# Altium schematic sheet Engine Bay and Rear Tube.SchDoc: =DocumentName
size 420 x 297 mm; Organization: Queen's Formula SAE; Address1: 130 Stuart St, Kingston; Address2: Ontario; Address3: Canada; Address4: K7L 2V9; DocumentNumber: 1; Revision: 0; SheetNumber: 1; SheetTotal: 1
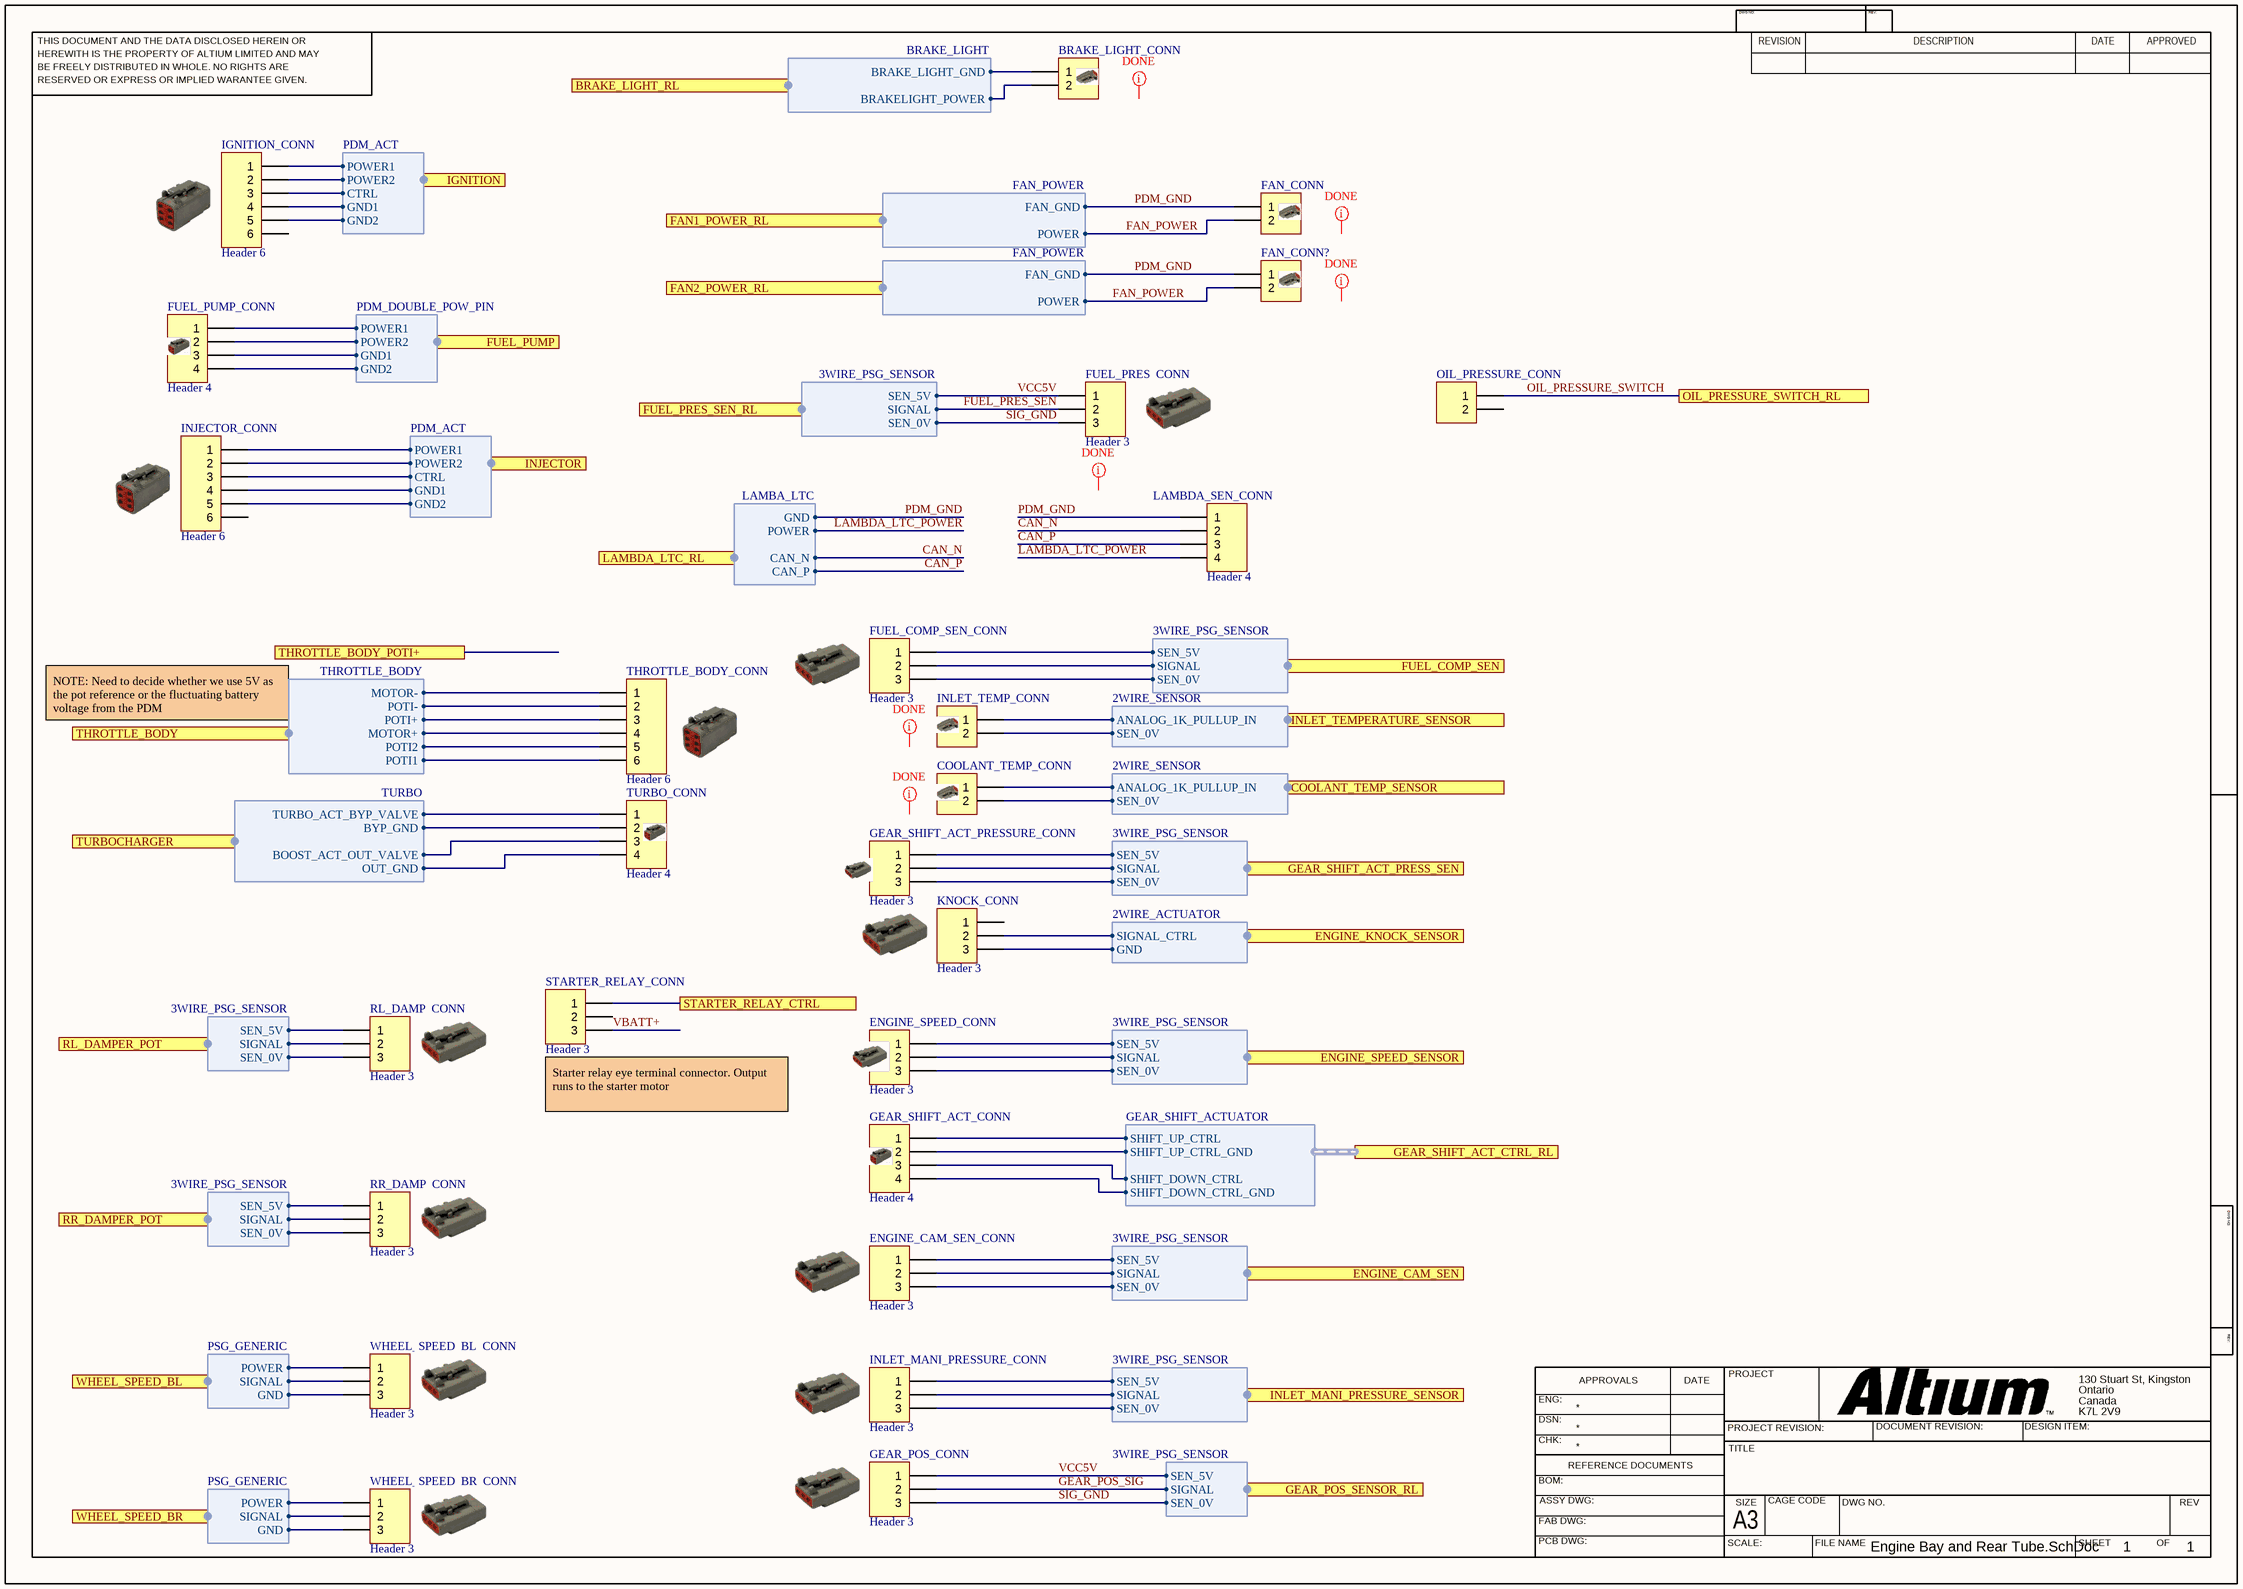
[diagram p0: Engine Bay and Rear Tube.SchDoc]

## Parts
BRAKE_LIGHT_CONN  Header 2  [HDR1X2]  (value not drawn)
COOLANT_TEMP_CONN  Header 2  [HDR1X2]  (value not drawn)
ENGINE_CAM_SEN_CONN  Header 3  [HDR1X3]
ENGINE_SPEED_CONN  Header 3  [HDR1X3]
FAN_CONN  Header 2  [HDR1X2]  (value not drawn)
FAN_CONN?  Header 2  [HDR1X2]  (value not drawn)
FUEL_COMP_SEN_CONN  Header 3  [HDR1X3]
FUEL_PRES_CONN  Header 3  [HDR1X3]
FUEL_PUMP_CONN  Header 4  [HDR1X4]
GEAR_POS_CONN  Header 3  [HDR1X3]
GEAR_SHIFT_ACT_CONN  Header 4  [HDR1X4]
GEAR_SHIFT_ACT_PRESSURE_CONN  Header 3  [HDR1X3]
IGNITION_CONN  Header 6  [HDR1X6]
INJECTOR_CONN  Header 6  [HDR1X6]
INLET_MANI_PRESSURE_CONN  Header 3  [HDR1X3]
INLET_TEMP_CONN  Header 2  [HDR1X2]  (value not drawn)
KNOCK_CONN  Header 3  [HDR1X3]
LAMBDA_SEN_CONN  Header 4  [HDR1X4]
OIL_PRESSURE_CONN  Header 2  [HDR1X2]  (value not drawn)
RL_DAMP_CONN  Header 3  [HDR1X3]
RR_DAMP_CONN  Header 3  [HDR1X3]
STARTER_RELAY_CONN  Header 3  [HDR1X3]
THROTTLE_BODY_CONN  Header 6  [HDR1X6]
TURBO_CONN  Header 4  [HDR1X4]
WHEEL_SPEED_BL_CONN  Header 3  [HDR1X3]
WHEEL_SPEED_BR_CONN  Header 3  [HDR1X3]

## Ports
BRAKE_LIGHT_RL (harness BRAKE_LIGHT), COOLANT_TEMP_SENSOR (harness 2WIRE_SENSOR), ENGINE_CAM_SEN (harness 3WIRE_PSG_SENSOR), ENGINE_KNOCK_SENSOR (harness 2WIRE_ACTUATOR), ENGINE_SPEED_SENSOR (harness 3WIRE_PSG_SENSOR), FAN1_POWER_RL (harness FAN_POWER), FAN2_POWER_RL (harness FAN_POWER), FUEL_COMP_SEN (harness 3WIRE_PSG_SENSOR), FUEL_PRES_SEN_RL (harness 3WIRE_PSG_SENSOR), FUEL_PUMP (harness PDM_DOUBLE_POW_PIN), GEAR_POS_SENSOR_RL (harness 3WIRE_PSG_SENSOR), GEAR_SHIFT_ACT_CTRL_RL (harness GEAR_SHIFT_ACTUATOR), GEAR_SHIFT_ACT_PRESS_SEN (harness 3WIRE_PSG_SENSOR), IGNITION (harness PDM_ACT), INJECTOR (harness PDM_ACT), INLET_MANI_PRESSURE_SENSOR (harness 3WIRE_PSG_SENSOR), INLET_TEMPERATURE_SENSOR (harness 2WIRE_SENSOR), LAMBDA_LTC_RL (harness LAMBA_LTC), OIL_PRESSURE_SWITCH_RL, RL_DAMPER_POT (harness 3WIRE_PSG_SENSOR), RR_DAMPER_POT (harness 3WIRE_PSG_SENSOR), STARTER_RELAY_CTRL, THROTTLE_BODY (harness THROTTLE_BODY), THROTTLE_BODY_POTI+, TURBOCHARGER (harness TURBO), WHEEL_SPEED_BL (harness PSG_GENERIC), WHEEL_SPEED_BR (harness PSG_GENERIC)

## Harnesses
2WIRE_SENSOR: ANALOG_1K_PULLUP_IN, SEN_0V
3WIRE_PSG_SENSOR: SEN_5V, SEN_0V, SIGNAL
2WIRE_ACTUATOR: SIGNAL_CTRL, GND
THROTTLE_BODY: MOTOR+, MOTOR-, POTI1, POTI2, POTI-, POTI+
GEAR_SHIFT_ACTUATOR: SHIFT_UP_CTRL, SHIFT_DOWN_CTRL, SHIFT_UP_CTRL_GND, SHIFT_DOWN_CTRL_GND
PDM_ACT: POWER1, CTRL, GND1, GND2, POWER2
TURBO: TURBO_ACT_BYP_VALVE, BOOST_ACT_OUT_VALVE, BYP_GND, OUT_GND
PDM_DOUBLE_POW_PIN: POWER1, GND1, GND2, POWER2
BRAKE_LIGHT: BRAKELIGHT_POWER, BRAKE_LIGHT_GND
PSG_GENERIC: POWER, GND, SIGNAL
FAN_POWER: POWER, FAN_GND
LAMBA_LTC: CAN_P, CAN_N, POWER, GND

## Nets
CAN_N: LAMBDA_SEN_CONN.2 ; port LAMBDA_LTC_RL.CAN_N
CAN_P: LAMBDA_SEN_CONN.3 ; port LAMBDA_LTC_RL.CAN_P
FAN_POWER: FAN_CONN.2 FAN_CONN?.2 ; port FAN1_POWER_RL.POWER, port FAN2_POWER_RL.POWER
FUEL_PRES_SEN: FUEL_PRES_CONN.2 ; port FUEL_PRES_SEN_RL.SIGNAL
GEAR_POS_SIG: GEAR_POS_CONN.2 ; port GEAR_POS_SENSOR_RL.SIGNAL
LAMBDA_LTC_POWER: LAMBDA_SEN_CONN.4 ; port LAMBDA_LTC_RL.POWER
OIL_PRESSURE_SWITCH: OIL_PRESSURE_CONN.1 ; port OIL_PRESSURE_SWITCH_RL
PDM_GND: FAN_CONN.1 FAN_CONN?.1 LAMBDA_SEN_CONN.1 ; port FAN1_POWER_RL.FAN_GND, port FAN2_POWER_RL.FAN_GND, port LAMBDA_LTC_RL.GND
SIG_GND: FUEL_PRES_CONN.3 GEAR_POS_CONN.3 ; port GEAR_POS_SENSOR_RL.SEN_0V, port FUEL_PRES_SEN_RL.SEN_0V
STARTER_RELAY_CTRL: STARTER_RELAY_CONN.1 ; port STARTER_RELAY_CTRL
VBATT+: STARTER_RELAY_CONN.3
VCC5V: FUEL_PRES_CONN.1 GEAR_POS_CONN.1 ; port GEAR_POS_SENSOR_RL.SEN_5V, port FUEL_PRES_SEN_RL.SEN_5V
NetBRAKE_LIGHT_CONN_1: BRAKE_LIGHT_CONN.1 ; port BRAKE_LIGHT_RL.BRAKE_LIGHT_GND
NetBRAKE_LIGHT_CONN_2: BRAKE_LIGHT_CONN.2 ; port BRAKE_LIGHT_RL.BRAKELIGHT_POWER
NetCOOLANT_TEMP_CONN_1: COOLANT_TEMP_CONN.1 ; port COOLANT_TEMP_SENSOR.ANALOG_1K_PULLUP_IN
NetCOOLANT_TEMP_CONN_2: COOLANT_TEMP_CONN.2 ; port COOLANT_TEMP_SENSOR.SEN_0V
NetENGINE_CAM_SEN_CONN_1: ENGINE_CAM_SEN_CONN.1 ; port ENGINE_CAM_SEN.SEN_5V
NetENGINE_CAM_SEN_CONN_2: ENGINE_CAM_SEN_CONN.2 ; port ENGINE_CAM_SEN.SIGNAL
NetENGINE_CAM_SEN_CONN_3: ENGINE_CAM_SEN_CONN.3 ; port ENGINE_CAM_SEN.SEN_0V
NetENGINE_SPEED_CONN_1: ENGINE_SPEED_CONN.1 ; port ENGINE_SPEED_SENSOR.SEN_5V
NetENGINE_SPEED_CONN_2: ENGINE_SPEED_CONN.2 ; port ENGINE_SPEED_SENSOR.SIGNAL
NetENGINE_SPEED_CONN_3: ENGINE_SPEED_CONN.3 ; port ENGINE_SPEED_SENSOR.SEN_0V
NetFUEL_COMP_SEN_CONN_1: FUEL_COMP_SEN_CONN.1 ; port FUEL_COMP_SEN.SEN_5V
NetFUEL_COMP_SEN_CONN_2: FUEL_COMP_SEN_CONN.2 ; port FUEL_COMP_SEN.SIGNAL
NetFUEL_COMP_SEN_CONN_3: FUEL_COMP_SEN_CONN.3 ; port FUEL_COMP_SEN.SEN_0V
NetFUEL_PUMP_CONN_1: FUEL_PUMP_CONN.1 ; port FUEL_PUMP.POWER1
NetFUEL_PUMP_CONN_2: FUEL_PUMP_CONN.2 ; port FUEL_PUMP.POWER2
NetFUEL_PUMP_CONN_3: FUEL_PUMP_CONN.3 ; port FUEL_PUMP.GND1
NetFUEL_PUMP_CONN_4: FUEL_PUMP_CONN.4 ; port FUEL_PUMP.GND2
NetGEAR_SHIFT_ACT_CONN_1: GEAR_SHIFT_ACT_CONN.1 ; port GEAR_SHIFT_ACT_CTRL_RL.SHIFT_UP_CTRL
NetGEAR_SHIFT_ACT_CONN_2: GEAR_SHIFT_ACT_CONN.2 ; port GEAR_SHIFT_ACT_CTRL_RL.SHIFT_UP_CTRL_GND
NetGEAR_SHIFT_ACT_CONN_3: GEAR_SHIFT_ACT_CONN.3 ; port GEAR_SHIFT_ACT_CTRL_RL.SHIFT_DOWN_CTRL
NetGEAR_SHIFT_ACT_CONN_4: GEAR_SHIFT_ACT_CONN.4 ; port GEAR_SHIFT_ACT_CTRL_RL.SHIFT_DOWN_CTRL_GND
NetGEAR_SHIFT_ACT_PRESSURE_CONN_1: GEAR_SHIFT_ACT_PRESSURE_CONN.1 ; port GEAR_SHIFT_ACT_PRESS_SEN.SEN_5V
NetGEAR_SHIFT_ACT_PRESSURE_CONN_2: GEAR_SHIFT_ACT_PRESSURE_CONN.2 ; port GEAR_SHIFT_ACT_PRESS_SEN.SIGNAL
NetGEAR_SHIFT_ACT_PRESSURE_CONN_3: GEAR_SHIFT_ACT_PRESSURE_CONN.3 ; port GEAR_SHIFT_ACT_PRESS_SEN.SEN_0V
NetIGNITION_CONN_1: IGNITION_CONN.1 ; port IGNITION.POWER1
NetIGNITION_CONN_2: IGNITION_CONN.2 ; port IGNITION.POWER2
NetIGNITION_CONN_3: IGNITION_CONN.3 ; port IGNITION.CTRL
NetIGNITION_CONN_4: IGNITION_CONN.4 ; port IGNITION.GND1
NetIGNITION_CONN_5: IGNITION_CONN.5 ; port IGNITION.GND2
NetINJECTOR_CONN_1: INJECTOR_CONN.1 ; port INJECTOR.POWER1
NetINJECTOR_CONN_2: INJECTOR_CONN.2 ; port INJECTOR.POWER2
NetINJECTOR_CONN_3: INJECTOR_CONN.3 ; port INJECTOR.CTRL
NetINJECTOR_CONN_4: INJECTOR_CONN.4 ; port INJECTOR.GND1
NetINJECTOR_CONN_5: INJECTOR_CONN.5 ; port INJECTOR.GND2
NetINLET_MANI_PRESSURE_CONN_1: INLET_MANI_PRESSURE_CONN.1 ; port INLET_MANI_PRESSURE_SENSOR.SEN_5V
NetINLET_MANI_PRESSURE_CONN_2: INLET_MANI_PRESSURE_CONN.2 ; port INLET_MANI_PRESSURE_SENSOR.SIGNAL
NetINLET_MANI_PRESSURE_CONN_3: INLET_MANI_PRESSURE_CONN.3 ; port INLET_MANI_PRESSURE_SENSOR.SEN_0V
NetINLET_TEMP_CONN_1: INLET_TEMP_CONN.1 ; port INLET_TEMPERATURE_SENSOR.ANALOG_1K_PULLUP_IN
NetINLET_TEMP_CONN_2: INLET_TEMP_CONN.2 ; port INLET_TEMPERATURE_SENSOR.SEN_0V
NetKNOCK_CONN_2: KNOCK_CONN.2 ; port ENGINE_KNOCK_SENSOR.SIGNAL_CTRL
NetKNOCK_CONN_3: KNOCK_CONN.3 ; port ENGINE_KNOCK_SENSOR.GND
NetRL_DAMP_CONN_1: RL_DAMP_CONN.1 ; port RL_DAMPER_POT.SEN_5V
NetRL_DAMP_CONN_2: RL_DAMP_CONN.2 ; port RL_DAMPER_POT.SIGNAL
NetRL_DAMP_CONN_3: RL_DAMP_CONN.3 ; port RL_DAMPER_POT.SEN_0V
NetRR_DAMP_CONN_1: RR_DAMP_CONN.1 ; port RR_DAMPER_POT.SEN_5V
NetRR_DAMP_CONN_2: RR_DAMP_CONN.2 ; port RR_DAMPER_POT.SIGNAL
NetRR_DAMP_CONN_3: RR_DAMP_CONN.3 ; port RR_DAMPER_POT.SEN_0V
NetTHROTTLE_BODY_CONN_1: THROTTLE_BODY_CONN.1 ; port THROTTLE_BODY.MOTOR-
NetTHROTTLE_BODY_CONN_2: THROTTLE_BODY_CONN.2 ; port THROTTLE_BODY.POTI-
NetTHROTTLE_BODY_CONN_3: THROTTLE_BODY_CONN.3 ; port THROTTLE_BODY.POTI+
NetTHROTTLE_BODY_CONN_4: THROTTLE_BODY_CONN.4 ; port THROTTLE_BODY.MOTOR+
NetTHROTTLE_BODY_CONN_5: THROTTLE_BODY_CONN.5 ; port THROTTLE_BODY.POTI2
NetTHROTTLE_BODY_CONN_6: THROTTLE_BODY_CONN.6 ; port THROTTLE_BODY.POTI1
NetTURBO_CONN_1: TURBO_CONN.1 ; port TURBOCHARGER.TURBO_ACT_BYP_VALVE
NetTURBO_CONN_2: TURBO_CONN.2 ; port TURBOCHARGER.BYP_GND
NetTURBO_CONN_3: TURBO_CONN.3 ; port TURBOCHARGER.BOOST_ACT_OUT_VALVE
NetTURBO_CONN_4: TURBO_CONN.4 ; port TURBOCHARGER.OUT_GND
NetWHEEL_SPEED_BL_CONN_1: WHEEL_SPEED_BL_CONN.1 ; port WHEEL_SPEED_BL.POWER
NetWHEEL_SPEED_BL_CONN_2: WHEEL_SPEED_BL_CONN.2 ; port WHEEL_SPEED_BL.SIGNAL
NetWHEEL_SPEED_BL_CONN_3: WHEEL_SPEED_BL_CONN.3 ; port WHEEL_SPEED_BL.GND
NetWHEEL_SPEED_BR_CONN_1: WHEEL_SPEED_BR_CONN.1 ; port WHEEL_SPEED_BR.POWER
NetWHEEL_SPEED_BR_CONN_2: WHEEL_SPEED_BR_CONN.2 ; port WHEEL_SPEED_BR.SIGNAL
NetWHEEL_SPEED_BR_CONN_3: WHEEL_SPEED_BR_CONN.3 ; port WHEEL_SPEED_BR.GND

Not connected (* = marked no-connect by the designer): IGNITION_CONN 6; INJECTOR_CONN 6; KNOCK_CONN 1; OIL_PRESSURE_CONN 2; STARTER_RELAY_CONN 2

## Layout directives
mark named DONE: (no net found under the mark)

## Notes on the sheet
- NOTE: Need to decide whether we use 5V as the pot reference or the fluctuating battery voltage from the PDM
- (near STARTER_RELAY_CONN) Starter relay eye terminal connector. Output runs to the starter motor
- THIS DOCUMENT AND THE DATA DISCLOSED HEREIN OR
- HEREWITH IS THE PROPERTY OF ALTIUM LIMITED AND MAY
- DWG NO:
- REVISION
- REV:
- DESCRIPTION
- DATE
- APPROVED
- BE FREELY DISTRIBUTED IN WHOLE. NO RIGHTS ARE
- RESERVED OR EXPRESS OR IMPLIED WARANTEE GIVEN.
- ENG:
- APPROVALS
- PROJECT
- DSN:
- CHK:
- REFERENCE DOCUMENTS
- PROJECT REVISION:
- TITLE
- DOCUMENT REVISION:
- DESIGN ITEM:
- BOM:
- FAB DWG:
- PCB DWG:
- ASSY DWG:
- SCALE:
- A3
- SIZE
- CAGE CODE
- FILE NAME
- DWG NO.
- SHEET
- OF
- REV

## Library data of the parts
BRAKE_LIGHT_CONN COOLANT_TEMP_CONN FAN_CONN FAN_CONN? INLET_TEMP_CONN OIL_PRESSURE_CONN = Header 2: Header, 2-Pin; LatestRevisionDate: 17-Jul-2002; LatestRevisionNote: Re-released for DXP Platform.; Publisher: Altium Limited
ENGINE_CAM_SEN_CONN ENGINE_SPEED_CONN FUEL_COMP_SEN_CONN FUEL_PRES_CONN GEAR_POS_CONN GEAR_SHIFT_ACT_PRESSURE_CONN INLET_MANI_PRESSURE_CONN KNOCK_CONN RL_DAMP_CONN RR_DAMP_CONN STARTER_RELAY_CONN WHEEL_SPEED_BL_CONN WHEEL_SPEED_BR_CONN = Header 3: Header, 3-Pin; LatestRevisionDate: 17-Jul-2002; LatestRevisionNote: Re-released for DXP Platform.; Publisher: Altium Limited
FUEL_PUMP_CONN GEAR_SHIFT_ACT_CONN LAMBDA_SEN_CONN TURBO_CONN = Header 4: Header, 4-Pin; LatestRevisionDate: 17-Jul-2002; LatestRevisionNote: Re-released for DXP Platform.; Publisher: Altium Limited
IGNITION_CONN INJECTOR_CONN THROTTLE_BODY_CONN = Header 6: Header, 6-Pin; LatestRevisionDate: 17-Jul-2002; LatestRevisionNote: Re-released for DXP Platform.; Publisher: Altium Limited